# Altium schematic sheet RELAY1.SchDoc
size A4
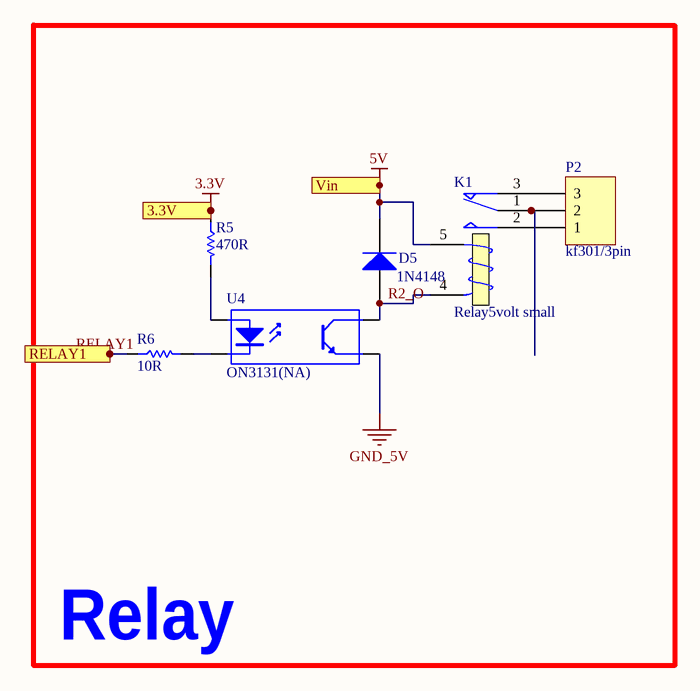
[diagram p0: RELAY1.SchDoc]

## Parts
D5  1N4148  [sod123]
K1  Relay5volt small  [relay5_childern]
P2  kf301/3pin  [Blue Connector 1*3 -kf301]
R5  470R  [0805/resistor]
R6  10R  [0805/resistor]
U4  ON3131(NA)  [OPTO_COUPLER]

## Blocks framed on the sheet
Relay: D5 K1 P2 R5 R6 U4

## Ports
3.3V, RELAY1, Vin

## Nets
3.3V: R5.1 ; port 3.3V
5V: D5.K K1.5 ; port Vin
GND_5V: U4.3(E)
R2_O: D5.A K1.4(T2) U4.4(C)
RELAY1: R6.1 ; port RELAY1
NetK1_1: K1.1(COM) P2.2
NetK1_2: K1.2(NO) P2.1
NetK1_3: K1.3(T1) P2.3
NetR5_2: R5.2 U4.1(A)
NetR6_2: R6.2 U4.2(K)

## Library data of the parts
D5 = Diode 1N4007: 1 Amp General Purpose Rectifier; Published: 8-Jun-2000; LatestRevisionDate: 17-Jul-2002; LatestRevisionNote: Re-released for DXP Platform.; DatasheetVersion: 1998; PackageVersion: Aug-1999; PackageReference: DO-41; Publisher: Altium Limited; PackageDescription: Diode, Axial; Body 5.2 x 2.7 mm (LxDia. max), Lead Dia. 0.86 mm (max); Code_JEDEC: DO-204-AL; ComponentLink1Description: Manufacturer Link; ComponentLink1URL: http://www.fairchildsemi.com/; ComponentLink2Description: Datasheet; ComponentLink2URL: http://www.fairchildsemi.com/ds/1N%2F1N4001.pdf
K1 = Relay: SPDT Relay; Published: 8-Jun-2000; LatestRevisionDate: 17-Jul-2002; LatestRevisionNote: Re-released for DXP Platform.; PackageReference: MODULE5B; Publisher: Altium Limited
P2 = Header 3: LatestRevisionDate: 17-Jul-2002; LatestRevisionNote: Re-released for DXP Platform.; Publisher: Altium Limited
R5 R6 = Resistor: Tolerance: 5%; Power: 1/8 W
  R5: Value: 470R
  R6: Value: 10R
U4 = Optoisolator1: 4-Pin Phototransistor Optocoupler; Published: 24-Mar-1999; LatestRevisionDate: 04-Mar-2005; LatestRevisionNote: Sch pins 3 & 4 Swapped.; DatasheetVersion: Nov-2003; PackageReference: DIP-4; Publisher: Altium Limited